# Altium project ESP12F_infrared.PrjPcb
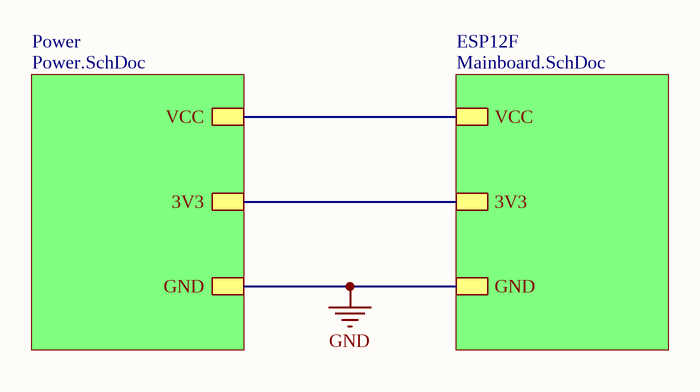
[diagram p0: toplevel.SchDoc]
3 sheets, 18 parts. Net scope: hierarchical (ports join the sheet entries above them; power ports are global).
Board file: Mainboard.PcbDoc
Sheets:
  toplevel.SchDoc
    ESP12F = Mainboard.SchDoc
    Power = Power.SchDoc

## Sheet toplevel.SchDoc
size A4

### Sub-sheets
ESP12F = Mainboard.SchDoc: GND, 3V3, VCC
Power = Power.SchDoc: GND, 3V3, VCC

### Nets
3V3: sheet ESP12F/3V3, sheet Power/3V3
GND: sheet ESP12F/GND, sheet Power/GND
VCC: sheet ESP12F/VCC, sheet Power/VCC

## Sheet Mainboard.SchDoc
size A4
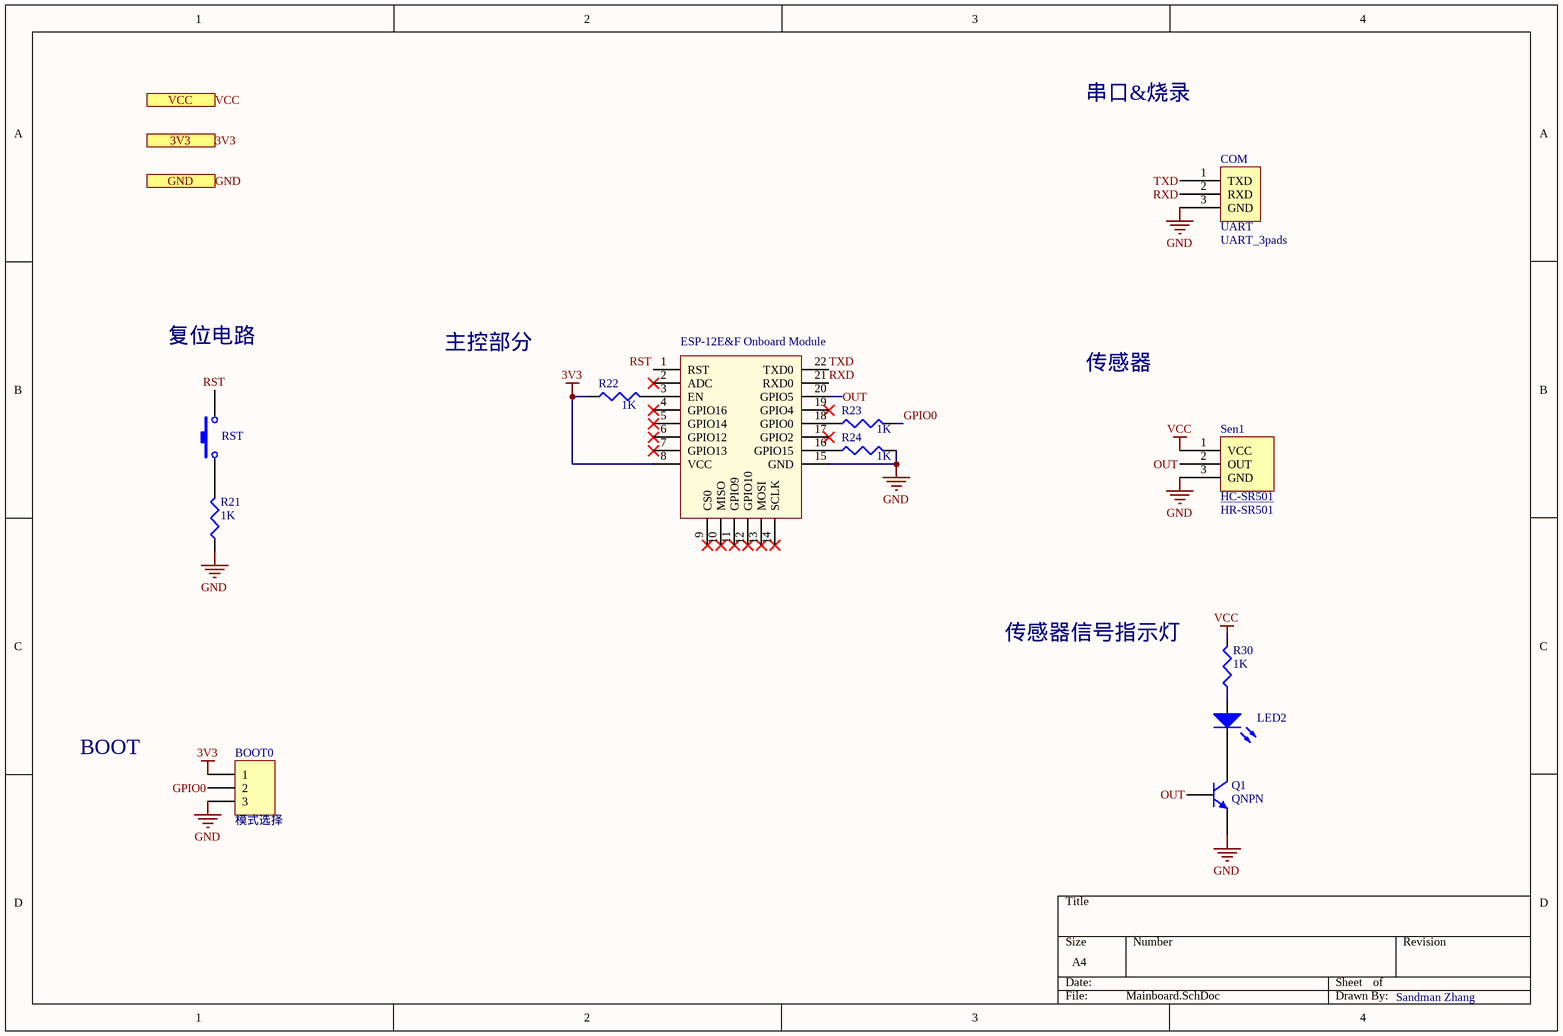
[diagram p1: Mainboard.SchDoc]

### Parts
BOOT0  模式选择  [HDR1X3]
COM  UART_3pads  [3pads]
LED2  LED3  [6-0805_N]  (value not drawn)
Q1  QNPN  [SOT-23B_N]
R21  value 1K  [J1-0603]  (hidden comment: Res3)
R22  value 1K  [J1-0603]  (hidden comment: Res3)
R23  value 1K  [J1-0603]  (hidden comment: Res3)
R24  value 1K  [J1-0603]  (hidden comment: Res3)
R30  value 1K  [6-0805_N]  (hidden comment: Res3)
RST  SW-PB  [SPST-2]  (value not drawn)
Sen1  HR-SR501  [HR-SR501]
U1  ESP-12E&F Onboard Module  [ESP-12E&F Module]

### Ports
3V3, GND, VCC

### Nets
3V3: BOOT0.1 R22.1 U1.8(VCC) ; port 3V3
GND: BOOT0.3 COM.3(GND) Q1.3(E) R21.1 R24.2 Sen1.3(GND) U1.15(GND) ; port GND
VCC: R30.2 Sen1.1(VCC) ; port VCC
GPIO0: BOOT0.2 R23.2
OUT: Q1.2(B) Sen1.2(OUT) U1.20(GPIO5)
RST: RST.2 U1.1(RST)
RXD: COM.2(RXD) U1.21(RXD0)
TXD: COM.1(TXD) U1.22(TXD0)
NetLED2_1: LED2.1(A) R30.1
NetLED2_2: LED2.2(K) Q1.1(C)
NetR21_2: R21.2 RST.1
NetR22_2: R22.2 U1.3(EN)
NetR23_1: R23.1 U1.18(GPIO0)
NetR24_1: R24.1 U1.16(GPIO15)

Not connected (* = marked no-connect by the designer): U1 2(ADC)* 4(GPIO16)* 5(GPIO14)* 6(GPIO12)* 7(GPIO13)* 9(CS0)* 10(MISO)* 11(GPIO9)* 12(GPIO10)* 13(MOSI)* 14(SCLK)* 17(GPIO2)* 19(GPIO4)*

### Notes on the sheet
- 串口&烧录
- 复位电路
- 主控部分
- 传感器
- 传感器信号指示灯
- BOOT
- Sandman Zhang
- (in symbol HR-SR501) HC-SR501
- (in symbol UART_3pads) UART

### Library data of the parts
BOOT0 = Header 3: Header, 3-Pin; LatestRevisionDate: 17-Jul-2002; LatestRevisionNote: Re-released for DXP Platform.; Publisher: Altium Limited
LED2 = LED3: Typical BLUE SiC LED; Published: 8-Jun-2000; LatestRevisionDate: 17-Dec-2003; LatestRevisionNote: PCB Footprint replaced.; DatasheetVersion: 16-Apr-2002; PackageVersion: 16-Apr-2002; PackageReference: 3.5X2.8X1.9; Publisher: Altium Limited; PackageDescription: SM LED; 2 C-Bend Leads; Body 3.5 x 2.8 x 1.9 mm, inc leads (LxWxH typ)
Q1 = QNPN: NPN Bipolar Transistor; Published: 8-Jun-2000; LatestRevisionDate: 29-May-2009; LatestRevisionNote: IPC-7351 Footprint Added.; PackageVersion: Aug-1999; PackageReference: SOT-23B; Publisher: Altium Limited; PackageDescription: 3-Pin SOT-23 Package 0.95 mm Pitch, 2.4 mm Lead Span
R21-R24 R30 = Res3: Resistor; Published: 8-Jun-2000; LatestRevisionDate: 29-May-2009; LatestRevisionNote: IPC-7351 Footprint Added.; PackageReference: J1-0603; Publisher: Altium Limited; PackageDescription: Chip Resistor
RST = SW-PB: Switch; Published: 24-Mar-1999; LatestRevisionDate: 17-Jul-2002; LatestRevisionNote: Re-released for DXP Platform.; PackageReference: SPST-2; Publisher: Altium Limited; PackageDescription: Switch; 2 Leads
Sen1 = HR-SR501: 人体红外感应模块

## Sheet Power.SchDoc
size A4
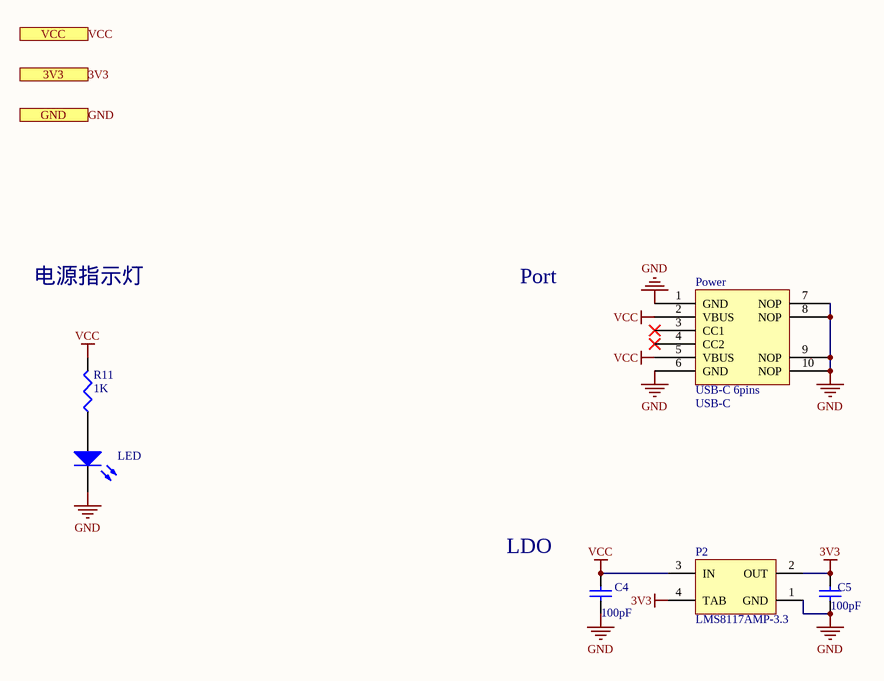
[diagram p2: Power.SchDoc]

### Parts
C4  value 100pF  [6-0805_N]  (hidden comment: Cap)
C5  value 100pF  [6-0805_N]  (hidden comment: Cap)
LED  LED3  [6-0805_N]  (value not drawn)
P2  LMS8117AMP-3.3  [MP04A_N]
Power  USB-C  [USB-C]
R11  value 1K  [6-0805_N]  (hidden comment: Res3)

### Ports
3V3, GND, VCC

### Nets
3V3: C5.2 P2.2(OUT) P2.4(TAB) ; port 3V3
GND: C4.1 C5.1 LED.2(K) P2.1(GND) Power.1(GND) Power.6(GND) Power.7(NOP) Power.8(NOP) Power.9(NOP) Power.10(NOP) ; port GND
VCC: C4.2 P2.3(IN) Power.2(VBUS) Power.5(VBUS) R11.2 ; port VCC
NetLED_1: LED.1(A) R11.1

Not connected (* = marked no-connect by the designer): Power 3(CC1)* 4(CC2)*

### Notes on the sheet
- 电源指示灯
- Port
- LDO
- (in symbol USB-C) USB-C 6pins

### Library data of the parts
C4 C5 = Cap: Capacitor; Published: 8-Jun-2000; LatestRevisionDate: 17-Jul-2002; LatestRevisionNote: Re-released for DXP Platform.; PackageReference: RAD-0.3; Publisher: Altium Limited; PackageDescription: Radial Cap, Thru-Hole; 2 Leads; 0.3 in Pin Spacing
LED = LED3: Typical BLUE SiC LED; Published: 8-Jun-2000; LatestRevisionDate: 17-Dec-2003; LatestRevisionNote: PCB Footprint replaced.; DatasheetVersion: 16-Apr-2002; PackageVersion: 16-Apr-2002; PackageReference: 3.5X2.8X1.9; Publisher: Altium Limited; PackageDescription: SM LED; 2 C-Bend Leads; Body 3.5 x 2.8 x 1.9 mm, inc leads (LxWxH typ)
P2 = LMS8117AMP-3.3: 1A Low-Dropout Linear Regulator, 4-pin SOT-223; Manufacturer: National Semiconductor; PackageTopMarking: XYTT*LS01; PowerWise: N; CompType: LDO IC; High-Reliability: Y; DatasheetVersion: Apr-2005; PackageVersion: revB, Apr-2003; PackageReference: MP04A; PackageDescription: Molded SOT-223, 6.50 x 3.56 x 1.6mm Body, 4 Lead, 2.3mm Pitch; PartNumber: LMS8117AMP-3.3; RoHS: N; PinCount: 4; Code_JEDEC: TO-261-AA; Code_IPC: SOT223-4; ComponentLink1Description: Manufacturer URL; ComponentLink1URL: http://www.national.com/; ComponentLink2Description: LMS8117A Datasheet; ComponentLink2URL: http://www.national.com/ds/LM/LMS8117A.pdf; ComponentLink3Description: LMS8117A Web Page; ComponentLink3URL: http://www.national.com/pf/LM/LMS8117A.html; ComponentLink4Description: MP04A Package Page; ComponentLink4URL: http://www.national.com/packaging/folders/mp04a.html
R11 = Res3: Resistor; Published: 8-Jun-2000; LatestRevisionDate: 29-May-2009; LatestRevisionNote: IPC-7351 Footprint Added.; PackageReference: J1-0603; Publisher: Altium Limited; PackageDescription: Chip Resistor

## Nets that join several sheets
3V3: Mainboard (BOOT0.1 R22.1 U1.8), Power (C5.2 P2.2 P2.4)
GND: Mainboard (7 pins), Power (10 pins)
VCC: Mainboard (R30.2 Sen1.1), Power (5 pins)